# EasyEDA Pro project 16316339.epro, board 15F_PCB
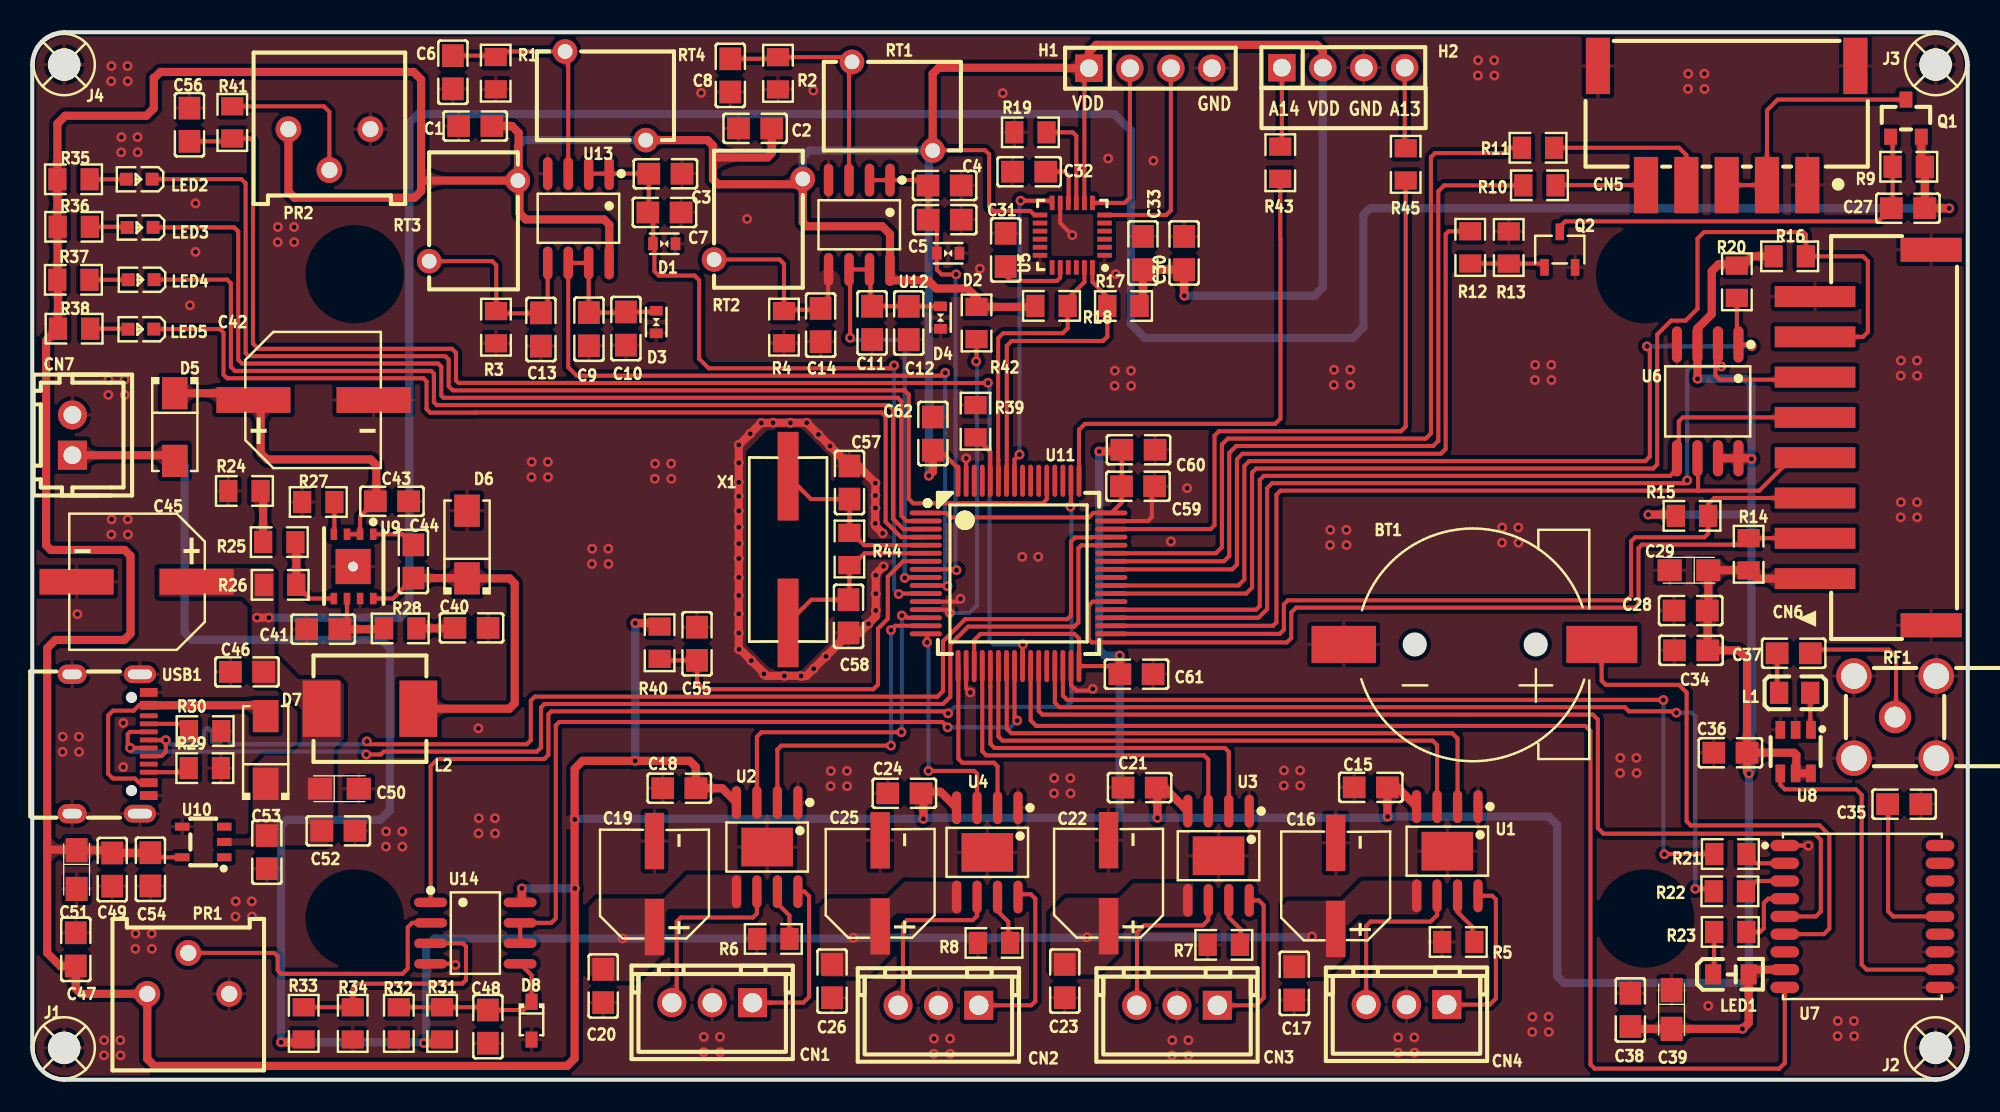
[diagram p4: board, top side]
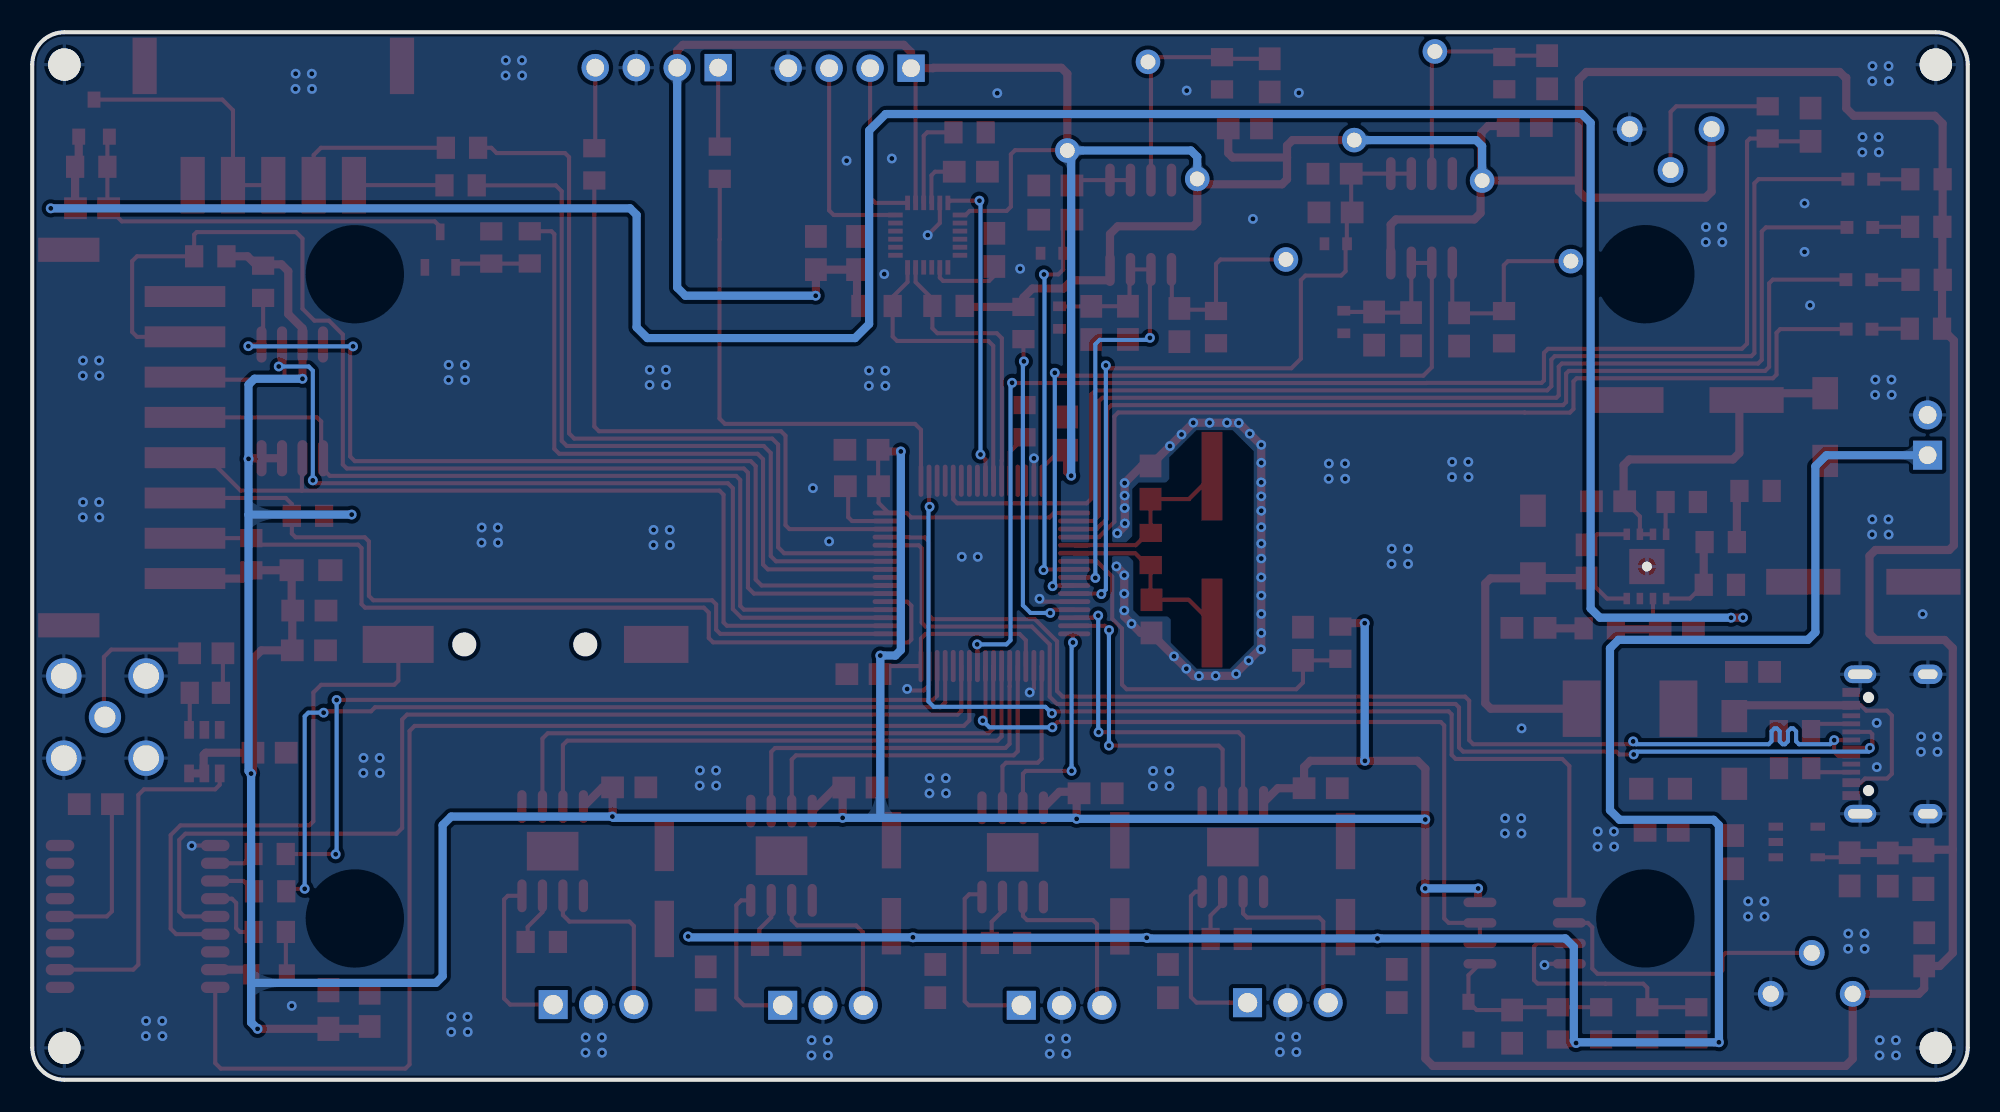
[diagram p5: board, bottom side, seen from below]

Outline 120 x 65 mm; copper layers: Top Layer, Bottom Layer. Coordinates in mm from the lower left corner of the outline.
Outline path: 0,63 0,2 arc(0.59,0.59) 2,0 118,0 arc(119.41,0.59) 120,2 120,63 arc(119.41,64.41) 118,65 2,65 arc(0.59,64.41) 0,63
Stack: Top Layer 0.035mm / Dielectric1 1.51mm FR4 er 4.5 / Bottom Layer 0.035mm

## Design rules (mm)
net USB_DP: usb
net USB_DN: usb
template: 自定义配置
spacing copperThickness1oz (default): track to track 0.203, other pairs 0.165 to 0.203
spacing copperThickness2oz: track to track 0.203, other pairs 0.152 to 0.3
track width copperThickness1oz (default): min 0.254, default 0.254, max 2.54
track width pwr: min 0.254, default 0.508, max 2.54
differential pair differentialPair (default): width min 0.254, default 0.254, max 2.54; gap min 0.203, default 0.203
via viaSize (default): diameter min 0.61, default 0.61, max 10; hole min 0.305, default 0.305, max 6.299
net GND uses pwr
net VDD uses pwr
net VBAT uses pwr
net +5V0 uses pwr
net VBUS uses pwr
net 4G_PWR uses pwr

## Placement (name value [footprint] x y rotation side)
BT1  CR1220-A  [BAT-SMD_CR1220-2]  89.31 27.01 180 top
C1  100nF  [C0805]  27.47 59.18 0 top
C2  100nF  [C0805]  44.82 59.03 0 top
C3  100nF  [C0805]  39.26 56.22 180 top
C4  100nF  [C0805]  56.57 55.49 180 top
C5  10nF  [C0805]  56.57 53.37 180 top
C6  100nF  [C0805]  26.08 62.52 90 top
C7  10nF  [C0805]  39.2 53.82 180 top
C8  100nF  [C0805]  43.28 62.32 90 top
C9  100nF  [C0805]  34.51 46.57 90 top
C10  10nF  [C0805]  36.81 46.61 90 top
C11  100nF  [C0805]  52.07 46.97 90 top
C12  10nF  [C0805]  54.34 46.96 90 top
C13  100nF  [C0805]  31.54 46.56 90 top
C14  100nF  [C0805]  48.88 46.83 90 top
C15  100nF  [C0805]  82.99 18.14 0 top
C16  100uF  [CAP-SMD_BD6.3-L6.6-W6.6-LS7.2-FD]  80.81 12.03 90 top
C17  100nF  [C0805]  78.24 5.98 90 top
C18  100nF  [C0805]  40.12 18.09 0 top
C19  100uF  [CAP-SMD_BD6.3-L6.6-W6.6-LS7.2-FD]  38.58 12.14 90 top
C20  100nF  [C0805]  35.4 5.82 90 top
C21  100nF  [C0805]  68.66 18.13 0 top
C22  100uF  [CAP-SMD_BD6.3-L6.6-W6.6-LS7.2-FD]  66.73 12.2 90 top
C23  100nF  [C0805]  64.01 6.12 90 top
C24  100nF  [C0805]  54.07 17.78 0 top
C25  100uF  [CAP-SMD_BD6.3-L6.6-W6.6-LS7.2-FD]  52.57 12.19 90 top
C26  100nF  [C0805]  49.59 6.12 90 top
C27  100nF  [C0805]  116.29 54.08 0 top
C28  100nF  [C0805]  102.82 29.11 180 top
C29  22uF  [CASE-A_3216]  102.72 31.62 180 top
C30  100nF  [C0805]  71.41 51.3 90 top
C31  2200pF  [C0805]  60.35 51.49 270 top
C32  100nF  [C0805]  61.81 56.35 180 top
C33  100nF  [C0805]  68.86 51.3 270 top
C34  100nF  [C0805]  102.85 26.64 180 top
C35  100nF  [C0805]  116.06 17.1 180 top
C36  100nF  [C0805]  105.29 20.29 180 top
C37  470pF  [C0805]  109.21 26.46 180 top
C38  100nF  [C0805]  99.08 4.33 270 top
C39  22uF  [CASE-A_3216]  101.64 4.36 270 top
C40  10nF  [C0805]  27.23 28.04 0 top
C41  15pF  [C0805]  18.04 27.95 0 top
C42  220uF  [CAP-SMD_BD8.0-L8.3-W8.3-LS9.3-FD]  17.44 42.18 0 top
C43  100nF  [C0805]  22.3 35.89 0 top
C44  100nF  [C0805]  23.63 32.16 90 top
C45  220uF  [CAP-SMD_BD8.0-L8.3-W8.3-LS9.3-FD]  6.47 30.9 180 top
C46  100nF  [C0805]  13.31 25.31 0 top
C47  100nF  [C0805]  2.7 8.09 90 top
C48  100nF  [C0805]  28.25 3.3 270 top
C49  100nF  [C0805]  4.96 13.04 270 top
C50  22uF  [CASE-A_3216]  19.04 18.06 0 top
C51  22uF  [CASE-A_3216]  2.75 13.04 270 top
C52  100nF  [C0805]  18.98 15.45 0 top
C53  10nF  [C0805]  14.54 14.12 270 top
C54  10nF  [C0805]  7.32 13.06 270 top
C55  100nF  [C0805]  41.22 27.05 90 top
C56  10nF  [C0805]  9.75 59.26 270 top
C57  20pF  [C0805]  50.67 37.06 270 top
C58  20pF  [C0805]  50.61 28.76 90 top
C59  100nF  [C0805]  68.56 36.83 0 top
C60  100nF  [C0805]  68.59 39.09 0 top
C61  100nF  [C0805]  68.46 25.17 0 top
C62  100nF  [C0805]  55.84 40.1 90 top
CN1  2.54-1*3P  [CONN-TH_C722693]  42.15 4.78 180 top
CN2  2.54-1*3P  [CONN-TH_C722693]  56.18 4.62 180 top
CN3  2.54-1*3P  [CONN-TH_C722693]  70.97 4.62 180 top
CN4  2.54-1*3P  [CONN-TH_C722693]  85.2 4.66 180 top
CN5  ZX-XH2.54-5PWT  [CONN-SMD_5P-P2.54_MEGASTAR_ZX-XH2.54-5PWT]  105.05 59.21 180 top
CN6  2.54-8P WT  [CONN-SMD_8P-P2.50_2.54-8P-WT]  114.13 39.85 90 top
CN7  ZX-XH2.54-2PZZ  [CONN-TH_2P-P2.50_HX25003-2A]  2.49 40 90 top
D1  H3V3LD5B  [SOD-523F_L1.7-W0.9-LS1.7-BI]  39.18 51.87 180 top
D2  H3V3LD5B  [SOD-523F_L1.7-W0.9-LS1.7-BI]  56.78 51.28 180 top
D3  H3V3LD5B  [SOD-523F_L1.7-W0.9-LS1.7-BI]  38.68 47.02 90 top
D4  H3V3LD5B  [SOD-523F_L1.7-W0.9-LS1.7-BI]  56.31 47.3 90 top
D5  SS34  [SMA_L4.3-W2.5-LS5.0-RD]  8.84 40.5 270 top
D6  SS34  [SMA_L4.3-W2.5-LS5.0-RD]  26.96 33.21 90 top
D7  SS34  [SMA_L4.3-W2.5-LS5.0-RD]  14.47 20.47 90 top
D8  BZT52C3V3S  [SOD-323_L1.8-W1.3-LS2.5-RD]  30.95 3.66 270 top
H1  -  [HDR-TH_4P-P2.54-V-F]  69.32 62.77 0 top
H2  -  [HDR-TH_4P-P2.54-V-M]  81.28 62.8 0 top
J1  -  [M2螺丝]  1.98 1.98 0 top
J2  -  [M2螺丝]  118.01 1.98 0 top
J3  -  [M2螺丝]  118.01 62.99 0 top
J4  -  [M2螺丝]  1.98 62.99 0 top
L1  6.8nH  [L0805]  109.27 24.01 180 top
L2  10uH  [IND-SMD_L7.3-W6.8]  20.94 23.03 180 top
LED1  -  [LED_0805]  105.37 6.53 0 top
LED2  -  [LED_0603]  6.58 55.87 180 top
LED3  -  [LED_0603]  6.64 52.88 180 top
LED4  -  [LED_0603]  6.7 49.64 180 top
LED5  -  [LED_0603]  6.69 46.57 180 top
PR1  10K  [R_3386P]  9.67 5.33 270 top
PR2  10K  [R_3386P]  18.42 58.99 90 top
Q1  AO3401A  [SOT-23_L2.9-W1.3-P1.90-LS2.4-BR]  116.17 59.67 270 top
Q2  S8050 J3Y  [SOT-23-3_L3.0-W1.7-P0.95-LS2.9-BR]  94.71 51.51 270 top
R1  4.7K  [R0805]  28.73 62.46 90 top
R2  4.7K  [R0805]  46.23 62.45 90 top
R3  4.7K  [R0805]  28.75 46.7 90 top
R4  4.7K  [R0805]  46.61 46.7 90 top
R5  0.1R  [R0805]  88.41 8.55 180 top
R6  0.1R  [R0805]  45.95 8.74 180 top
R7  0.1R  [R0805]  73.88 8.37 180 top
R8  0.1R  [R0805]  59.63 8.49 180 top
R9  10K  [R0805]  116.34 56.65 0 top
R10  1K  [R0805]  93.44 55.5 0 top
R11  1K  [R0805]  93.36 57.83 0 top
R12  4.7K  [R0805]  89.15 51.65 90 top
R13  4.7K  [R0805]  91.54 51.64 270 top
R14  10K  [R0805]  106.42 32.61 270 top
R15  10K  [R0805]  102.91 34.99 180 top
R16  10K  [R0805]  108.96 51.1 180 top
R17  10K  [R0805]  67.66 48.01 0 top
R18  10K  [R0805]  63.19 48.02 180 top
R19  10K  [R0805]  61.88 58.79 0 top
R20  10K  [R0805]  105.69 49.52 90 top
R21  330R  [R0805]  105.28 14.01 0 top
R22  330R  [R0805]  105.25 11.69 0 top
R23  330R  [R0805]  105.28 9.17 0 top
R24  ADJ  [R0805]  13.15 36.54 0 top
R25  10K  [R0805]  15.31 33.36 0 top
R26  ADJ  [R0805]  15.37 30.71 180 top
R27  47K  [R0805]  17.73 35.85 180 top
R28  27K  [R0805]  22.81 28.01 0 top
R29  5.1K  [R0805]  10.7 19.34 0 top
R30  5.1K  [R0805]  10.72 21.64 0 top
R31  10K  [R0805]  25.41 3.5 90 top
R32  2K  [R0805]  22.73 3.5 90 top
R33  10K  [R0805]  16.83 3.5 270 top
R34  2K  [R0805]  19.87 3.5 270 top
R35  300R  [R0805]  2.56 55.87 180 top
R36  300R  [R0805]  2.57 52.93 180 top
R37  300R  [R0805]  2.55 49.64 180 top
R38  300R  [R0805]  2.59 46.6 180 top
R39  10K  [R0805]  58.48 40.86 270 top
R40  10K  [R0805]  38.9 27.12 90 top
R41  10K  [R0805]  12.4 59.4 270 top
R42  0R  [R0805]  58.55 46.96 90 top
R43  100R  [R0805]  77.38 56.9 270 top
R44  1M  [R0805]  50.66 32.93 270 top
R45  100R  [R0805]  85.15 56.8 270 top
RF1  BWSMA-KWE-Z001  [SMA-TH_BWSMA-KWE-Z001]  115.49 22.5 0 top
RT1  NTC 5D-7  [RES-TH_L8.5-W5.5-P5.00-D0.6-S5.50]  53.32 60.41 180 top
RT2  NTC 5D-7  [RES-TH_L8.5-W5.5-P5.00-D0.6-S5.50]  45.02 53.4 270 top
RT3  NTC 5D-7  [RES-TH_L8.5-W5.5-P5.00-D0.6-S5.50]  27.36 53.29 270 top
RT4  NTC 5D-7  [RES-TH_L8.5-W5.5-P5.00-D0.6-S5.50]  35.54 61.06 180 top
U1  TB67H450FNG,EL  [HSOP-8_L5.0-W4.0-P1.27-LS6.2-BL-EP]  87.73 14.18 180 top
U2  TB67H450FNG,EL  [HSOP-8_L5.0-W4.0-P1.27-LS6.2-BL-EP]  45.56 14.44 180 top
U3  TB67H450FNG,EL  [HSOP-8_L5.0-W4.0-P1.27-LS6.2-BL-EP]  73.55 13.9 180 top
U4  TB67H450FNG,EL  [HSOP-8_L5.0-W4.0-P1.27-LS6.2-BL-EP]  59.21 14.11 180 top
U5  MPU6050  [QFN-24_L4.0-W4.0-P0.50-BL]  64.48 52.41 90 top
U6  W25Q32JVSSIQ  [SOIC-8_L5.3-W5.3-P1.27-LS8.0-BL]  103.88 42.1 180 top
U7  ATGM336H-5N31  [GPSM-SMD_ATGM336H-TR]  113.47 10.13 90 top
U8  AT2659S  [SOT-23-6_L2.9-W1.6-P0.95-LS2.8-BR]  109.33 20.36 90 top
U9  X3DC  [QN_X3DC]  21.14 33.85 270 top
U10  XC6206J332MR-G  [SOT-25_L3.0-W1.6-P0.95-LS2.8-BR]  10.6 14.75 0 top
U11  GD32F307RCT6  [LQFP-64_L10.0-W10.0-P0.50-LS12.0-BL]  61.15 31.42 270 top
U12  GS8552-SR  [SOIC-8_L4.9-W3.9-P1.27-LS6.0-BL]  51.27 53.05 180 top
U13  GS8552-SR  [SOIC-8_L4.9-W3.9-P1.27-LS6.0-BL]  33.86 53.45 180 top
U14  GS8552-SR  [SOIC-8_L4.9-W3.9-P1.27-LS6.0-BL]  27.47 9.1 270 top
USB1  TYPE-C 16PIN 2MD(073)  [USB-C-SMD_TYPE-C-6PIN-2MD-073]  4.85 20.84 270 top
X1  25MHz  [HC-49S_L11.4-W4.8]  46.86 32.9 90 top

## Footprints (pads in the part's own frame, mm; a bottom-side part is the same pattern mirrored in y, then rotated)
BAT-SMD_CR1220-2
  rect 4.4x2.3 smd: 1(-8,0)
  rect 4x2.3 smd: 2(8,0)
C0805
  rect 1.41x1.35 smd: 1(-1.03,0) 2(1.03,0)
CAP-SMD_BD6.3-L6.6-W6.6-LS7.2-FD
  rect 3.5x1.2 smd: 1(-2.67,0) 2(2.67,0)
CAP-SMD_BD8.0-L8.3-W8.3-LS9.3-FD
  rect 4.6x1.6 smd: 1(-3.724,0) 2(3.724,0)
CASE-A_3216
  rect 1.5x1.359 smd: 1(-1.2,0) 2(1.2,0)
CONN-SMD_5P-P2.54_MEGASTAR_ZX-XH2.54-5PWT
  rect 1.5x3.5 smd: 1(-5,3.7) 2(-2.5,3.7) 3(0,3.7) 4(2.5,3.7) 5(5,3.7) 6(7.98,-3.7) 7(-7.98,-3.7)
CONN-SMD_8P-P2.50_2.54-8P-WT
  rect 1.3x5 smd: 1(-8.75,3.6) 2(-6.25,3.6) 3(-3.75,3.6) 4(-1.25,3.6) 5(1.25,3.6) 6(3.75,3.6) 7(6.25,3.6) 8(8.75,3.6)
  rect 1.5x3.8 smd: 9(11.65,-3.6) 10(-11.65,-3.6)
CONN-TH_2P-P2.50_HX25003-2A
  rect 1.8x1.8 hole 1.1: 1(-1.25,0)
  round 1.8 hole 1.1: 2(1.25,0)
CONN-TH_C722693
  rect 1.8x1.8 hole 1.2: 1(-2.5,0)
  round 1.8 hole 1.2: 2(0,0) 3(2.5,0)
GPSM-SMD_ATGM336H-TR
  oval 0.7x1.773 smd: 1(4.4,4.811) 2(3.3,4.811) 3(2.2,4.811) 4(1.1,4.811) 5(0,4.811) 6(-1.1,4.811) 7(-2.2,4.811) 8(-3.3,4.811) 9(-4.4,4.811) 10(-4.4,-4.811) 11(-3.3,-4.811) 12(-2.2,-4.811) 13(-1.1,-4.811) 14(0,-4.811) 15(1.1,-4.811) 16(2.2,-4.811) 17(3.3,-4.811) 18(4.4,-4.811)
HC-49S_L11.4-W4.8
  rect 5.5x1.3 smd: 1(-4.553,0) 2(4.553,0)
HDR-TH_4P-P2.54-V-F
  rect 1.7x1.7 hole 1.1: 1(-3.81,0)
  round 1.7 hole 1.1: 2(-1.27,0) 3(1.27,0) 4(3.81,0)
HDR-TH_4P-P2.54-V-M
  rect 1.7x1.7 hole 1.1: 1(-3.81,0)
  round 1.7 hole 1.1: 2(-1.27,0) 3(1.27,0) 4(3.81,0)
HSOP-8_L5.0-W4.0-P1.27-LS6.2-BL-EP
  oval 0.574x2.038 smd: 1(-1.905,-2.769) 2(-0.635,-2.769) 3(0.635,-2.769) 4(1.905,-2.769) 5(1.905,2.769) 6(0.635,2.769) 7(-0.635,2.769) 8(-1.905,2.769)
  rect 3.2x2.4 smd: 9(0,0)
IND-SMD_L7.3-W6.8
  rect 2.35x3.5 smd: 1(-3,0) 2(3,0)
L0805
  rect 1.133x1.377 smd: 1(-0.966,0) 2(0.966,0)
LED_0603
  rect 0.8x0.8 smd: 1(-0.851,-0.01) 2(0.75,-0.005)
LED_0805
  rect 1x1.25 smd: 1(-1.15,0.005) 2(1.05,0.005)
LQFP-64_L10.0-W10.0-P0.50-LS12.0-BL
  oval 0.3x2 smd: 1(-3.75,-5.75) 2(-3.25,-5.75) 3(-2.75,-5.75) 4(-2.25,-5.75) 5(-1.75,-5.75) 6(-1.25,-5.75) 7(-0.75,-5.75) 8(-0.25,-5.75) 9(0.25,-5.75) 10(0.75,-5.75) 11(1.25,-5.75) 12(1.75,-5.75) 13(2.25,-5.75) 14(2.75,-5.75) 15(3.25,-5.75) 16(3.75,-5.75) 33(3.75,5.75) 34(3.25,5.75) 35(2.75,5.75) 36(2.25,5.75) 37(1.75,5.75) 38(1.25,5.75) 39(0.75,5.75) 40(0.25,5.75) 41(-0.25,5.75) 42(-0.75,5.75) 43(-1.25,5.75) 44(-1.75,5.75) 45(-2.25,5.75) 46(-2.75,5.75) 47(-3.25,5.75) 48(-3.75,5.75)
  oval 2x0.3 smd: 17(5.75,-3.75) 18(5.75,-3.25) 19(5.75,-2.75) 20(5.75,-2.25) 21(5.75,-1.75) 22(5.75,-1.25) 23(5.75,-0.75) 24(5.75,-0.25) 25(5.75,0.25) 26(5.75,0.75) 27(5.75,1.25) 28(5.75,1.75) 29(5.75,2.25) 30(5.75,2.75) 31(5.75,3.25) 32(5.75,3.75) 49(-5.75,3.75) 50(-5.75,3.25) 51(-5.75,2.75) 52(-5.75,2.25) 53(-5.75,1.75) 54(-5.75,1.25) 55(-5.75,0.75) 56(-5.75,0.25) 57(-5.75,-0.25) 58(-5.75,-0.75) 59(-5.75,-1.25) 60(-5.75,-1.75) 61(-5.75,-2.25) 62(-5.75,-2.75) 63(-5.75,-3.25) 64(-5.75,-3.75)
M2螺丝
  round 2 hole 2: 1(0,0)
QFN-24_L4.0-W4.0-P0.50-BL
  rect 0.3x0.9 smd: 1(-1.25,-2) 2(-0.75,-2) 3(-0.25,-2) 4(0.25,-2) 5(0.75,-2) 6(1.25,-2) 13(1.25,2) 14(0.75,2) 15(0.25,2) 16(-0.25,2) 17(-0.75,2) 18(-1.25,2)
  rect 0.9x0.3 smd: 7(2,-1.25) 8(2,-0.75) 9(2,-0.25) 10(2,0.25) 11(2,0.75) 12(2,1.25) 19(-2,1.25) 20(-2,0.75) 21(-2,0.25) 22(-2,-0.25) 23(-2,-0.75) 24(-2,-1.25)
QN_X3DC
  rect 0.711x0.406 smd: 1(0,0) 2(0,-0.813) 3(0,-1.625) 4(0,-2.438) 5(3.988,-2.438) 6(3.988,-1.625) 7(3.988,-0.813) 8(3.988,0)
  round 0.61 hole 1.31x0.305: 9(2.002,-1.248)
  rect 2.184x2.184 smd: 9(2.002,-1.248)
R0805
  rect 1.133x1.377 smd: 1(-1,0) 2(1,0)
R_3386P
  round 1.6 hole 1.001: 1(0,-2.54) 2(-2.54,0) 3(0,2.54)
RES-TH_L8.5-W5.5-P5.00-D0.6-S5.50
  round 1.524 hole 0.914: 1(-2.5,2.75) 2(2.5,-2.75)
SMA-TH_BWSMA-KWE-Z001
  round 2.2 hole 1.6: 1(-2.55,-2.55) 2(-2.55,2.55) 3(2.55,2.55) 4(2.55,-2.55)
  round 2 hole 1.3: 5(0,0)
SMA_L4.3-W2.5-LS5.0-RD
  rect 2x1.593 smd: 1(-2.1,0) 2(2.1,0)
SOD-323_L1.8-W1.3-LS2.5-RD
  rect 1x0.75 smd: 1(-1.173,0) 2(1.173,0)
SOD-523F_L1.7-W0.9-LS1.7-BI
  rect 0.6x0.8 smd: 1(-0.7,0) 2(0.7,0)
SOIC-8_L4.9-W3.9-P1.27-LS6.0-BL
  oval 0.588x2.045 smd: 1(-1.905,-2.772) 2(-0.635,-2.772) 3(0.635,-2.772) 4(1.905,-2.772) 5(1.905,2.772) 6(0.635,2.772) 7(-0.635,2.772) 8(-1.905,2.772)
SOIC-8_L5.3-W5.3-P1.27-LS8.0-BL
  oval 0.63x2.25 smd: 1(-1.905,-3.53) 2(-0.635,-3.53) 3(0.635,-3.53) 4(1.905,-3.53) 5(1.905,3.53) 6(0.635,3.53) 7(-0.635,3.53) 8(-1.905,3.53)
SOT-23-3_L3.0-W1.7-P0.95-LS2.9-BR
  rect 1.038x0.532 smd: 1(1.101,-0.95) 2(1.101,0.95) 3(-1.101,0)
SOT-23-6_L2.9-W1.6-P0.95-LS2.8-BR
  rect 1.1x0.6 smd: 1(1.35,-0.95) 2(1.35,0) 3(1.35,0.95) 4(-1.35,0.95) 5(-1.35,0) 6(-1.35,-0.95)
SOT-23_L2.9-W1.3-P1.90-LS2.4-BR
  rect 1x0.8 smd: 1(1.15,-0.95) 2(1.15,0.95) 3(-1.15,0)
SOT-25_L3.0-W1.6-P0.95-LS2.8-BR
  rect 0.9x0.5 smd: 1(1.3,-0.95) 2(1.3,0) 3(1.3,0.95) 4(-1.3,0.95) 5(-1.3,-0.95)
USB-C-SMD_TYPE-C-6PIN-2MD-073
  rect 0.55x1.1 smd: 1(-3.2,2.375) 2(-2.4,2.375) 11(2.4,2.375) 12(3.2,2.375)
  rect 0.3x1.1 smd: 3(-1.75,2.375) 4(-1.25,2.375) 5(-0.75,2.375) 6(-0.25,2.375) 7(0.25,2.375) 8(0.75,2.375) 9(1.25,2.375) 10(1.75,2.375)
  oval 1.1x2 hole 0.6x1.5: 13(-4.325,1.825) 14(4.325,1.825)
  oval 1.2x1.8 hole 0.6x1.2: 13(-4.325,-2.375) 14(4.325,-2.375)

## Nets
As in the schematic.

Pads without a net: U5 2 3 4 5 14 15 16 17 19 21 22; U7 7 13 15 16 17 18; U10 1 3; U11 28 40 51 52 54 55 56 61 62; USB1 3 9

## Via types
v1: diameter 0.61, hole 0.305, Top Layer to Bottom Layer, 257 vias

## Routing (per net, layer and track width the routed paths; a pad name or vN(x,y) marks a point on that pad's centre or on a via; arc(x,y) is an arc through that point)
+5V0: length 161.8
  Top Layer w0.508: v1(14.67,28.67) 14.67,28.67 v1(13.93,28.67) ; v1(118.85,54.07) 118.85,54.08 C27.2 117.34,54.1 R9.2 117.12,56.88 Q1.2
  Bottom Layer w0.508: v1(118.85,54.07) 82.94,54.07 82.53,53.67 82.53,46.69 81.86,46.02 68.99,46.02 68.12,46.89 68.12,58.9 67.09,59.92 23.92,59.92 23.38,59.38 23.38,29.25 22.81,28.67 v1(14.67,28.67)
GND: length 58.7
  Top Layer w0.254: U11.47 69.17,34.67 69.41,34.91 69.41,36.65 C59.2 ; U5.11 63.73,53.16 v1(64.48,52.41) ; U14.4 26.17,7.2 v1(26.24,7.12) ; U11.31 64.4,24.49 64.73,24.16 65.66,24.16 v1(65.76,24.25) ; v1(110.11,14.52) 110.1,14.53 U7.1 ; U11.12 57.38,29.67 v1(57.55,29.84) ; U11.18 57.9,24.29 v1(58.16,24.03) ; 57.9,37.17 v1(57.9,38.56)
  Top Layer w0.508: v1(52.78,31.86) 52.3,31.37 v1(52.3,31.3) v1(52.3,30.16) v1(52.3,29.12) 52.3,28.75 v1(51.84,28.3) 51.27,27.73 C58.1 50.61,27.67 v1(49.21,26.28) v1(48.45,25.51) 47.99,25.05 v1(47.66,25.05) 47.65,25.06 v1(46.63,25.06) 45.48,25.06 v1(45.36,25.18) 45.36,25.23 v1(44.58,26.01) 43.8,26.79 v1(43.8,27.72) v1(43.8,28.91) v1(43.8,30.05) v1(43.8,31.17) v1(43.8,32.34) v1(43.8,33.27) v1(43.8,34.29) v1(43.8,35.31) v1(43.8,36.2) v1(43.8,37.07) v1(43.8,38.29) v1(43.8,39.4) 43.82,39.4 v1(44.51,40.09) 45.18,40.75 v1(45.2,40.75) 45.91,40.75 v1(45.93,40.77) v1(47.01,40.77) v1(48.02,40.77) v1(48.75,40.04) v1(49.46,39.32) 50.67,38.12 C57.1 51.21,38.09 v1(52.27,37.03) v1(52.27,36.25) v1(52.27,35.47) 52.26,35.46 v1(52.26,34.52) 52.26,34.37 v1(52.73,33.91)
  vias: v1(1.89,21.29) v1(1.88,20.35) v1(2.8,28.89) v1(2.89,21.29) v1(2.9,20.35) v1(4.44,1.51) v1(4.46,2.45) v1(4.73,43.44) v1(4.72,42.5) v1(4.91,62.9) v1(4.89,61.96) v1(4.92,34.77) v1(4.9,33.83) v1(5.52,58.49) v1(5.51,57.55) v1(5.46,2.45) v1(5.47,1.51) v1(5.64,22.14) v1(5.64,19.4) v1(5.73,43.44) v1(5.74,42.5) v1(5.91,62.9) v1(5.92,61.96) v1(5.92,34.77) v1(5.93,33.83) v1(6.41,9.07) v1(6.39,8.13) v1(6.53,58.49) v1(6.54,57.55) v1(7.41,9.07) v1(7.42,8.13) v1(9.78,48.05) v1(10.12,54.38) v1(10.12,51.37) v1(12.61,11.07) v1(12.6,10.13) v1(13.61,11.07) v1(13.62,10.13) v1(15.23,52.91) v1(15.22,51.97) v1(16.23,52.91) v1(16.24,51.97) v1(21.94,15.41) v1(21.93,14.47) v1(22.94,15.41) v1(22.95,14.47) v1(27.66,21.81) v1(27.68,16.23) v1(27.67,15.29) v1(28.68,16.23) v1(28.69,15.29) v1(30.97,38.34) v1(30.95,37.4) v1(31.97,38.34) v1(31.98,37.4) v1(34.71,32.95) v1(34.7,32.01) v1(35.71,32.95) v1(35.72,32.01) v1(38.61,38.23) v1(38.6,37.29) v1(39.61,38.23) v1(39.62,37.29) v1(41.47,61.24) v1(41.64,2.66) v1(41.63,1.72) v1(42.64,2.66) v1(42.65,1.72) v1(43.82,26.7) v1(44.32,53.42) v1(48.43,61.38) v1(49.51,19.16) v1(49.5,18.22) v1(50.51,19.16) v1(50.52,18.22) v1(55.91,2.56) v1(55.89,1.61) v1(56.91,2.56) v1(56.92,1.61) v1(58.75,50.33) v1(60.17,61.22) v1(61.38,32.45) v1(62.37,32.45) v1(63.35,17.77) v1(63.36,18.71) v1(64.36,18.71) v1(64.37,17.77) v1(66.71,57.17) v1(67.12,44) v1(67.11,43.06) v1(67.18,49.99) v1(68.12,44) v1(68.13,43.06) v1(69.51,57.03) v1(70.59,33.41) v1(70.68,2.45) v1(70.67,1.51) v1(71.6,36.71) v1(71.68,2.45) v1(71.69,1.51) v1(77.61,19.19) v1(77.59,18.25) v1(78.61,19.19) v1(78.62,18.25) v1(80.48,34.12) v1(80.46,33.18) v1(80.71,44.05) v1(80.7,43.11) v1(81.48,34.12) v1(81.49,33.18) v1(81.71,44.05) v1(81.72,43.11) v1(84.69,2.62) v1(84.67,1.68) v1(85.69,2.62) v1(85.7,1.68) v1(89.64,63.26) v1(89.63,62.31) v1(90.64,63.26) v1(90.65,62.31) v1(91.13,34.27) v1(91.12,33.33) v1(92.14,34.27) v1(92.15,33.33) v1(93.01,3.91) v1(93,2.96) v1(93.18,44.36) v1(93.17,43.42) v1(94.01,3.91) v1(94.02,2.96) v1(94.18,44.36) v1(94.19,43.42) v1(98.45,19.03) v1(98.46,19.97) v1(99.46,19.97) v1(99.47,19.03) v1(102.67,62.43) v1(102.66,61.48) v1(103.67,62.43) v1(103.68,61.48) v1(103.91,4.59) v1(111.94,3.65) v1(111.93,2.71) v1(112.94,3.65) v1(112.95,2.71) v1(115.84,43.69) v1(115.84,34.9) v1(115.85,44.63) v1(115.85,35.84) v1(116.85,44.63) v1(116.87,43.69) v1(116.85,35.84) v1(116.87,34.9)
VBAT: length 140.6
  Top Layer w0.508: v1(15.43,2.33) 16.66,2.33 R33.2 ; CN7.1 8.48,38.75 D5.2 ; v1(24.28,2.28) 25.19,2.28 R31.1
  Bottom Layer w0.508: v1(79.34,8.9) 79.28,8.84 v1(65.4,8.84) 65.37,8.81 v1(50.9,8.81) 50.86,8.77 v1(36.6,8.77) 24.94,8.77 24.42,8.25 24.42,2.42 v1(24.28,2.28) 24.24,2.33 v1(15.43,2.33) 15.43,15.79 15.76,16.13 21.58,16.13 22.18,16.73 22.18,26.77 21.65,27.3 9.91,27.3 9.45,27.76 9.45,38.06 8.76,38.75 CN7.1
VBUS: length 16.7
  Top Layer w0.254: USB1.2 6.62,23.24 6.29,22.9 5.01,22.9 4.71,22.6 4.71,18.98 5,18.69 6.37,18.69 6.62,18.44 USB1.11
  Top Layer w0.508: USB1.2 13.8,23.24 D7.2
VDD: length 636.1
  Top Layer w0.254: U5.8 65.23,61.96 65.21,61.98 ; RT1.1 55.84,57.68 59.07,57.68 59.33,57.42 59.33,54.18 59.59,53.91 61.88,53.91 62.13,53.66 U5.13 ; C61.1 66.93,25.67 U11.32 64.9,27.38 64.61,27.67 58.79,27.67 58.4,27.27 U11.19 ; C60.1 67.56,36.86 C59.1 67.53,35.8 U11.48 65.78,35.17 65.51,34.89 56.93,34.89 56.65,35.17 U11.1 ; 109.37,19.05 U8.5 ; U10.5 7.54,13.81 7.46,13.88 ; U11.64 57.4,37.94 56.27,39.07 C62.1
  Top Layer w0.508: 33.63,11.87 33.63,19.3 34.12,19.79 40.76,19.79 41.15,19.41 41.15,18.09 42.78,18.09 U2.4 ; 33.63,11.87 v1(33.64,11.87) ; 33.63,11.87 33.63,1.32 33.17,0.86 7.57,0.86 7.13,1.3 PR1.1 3.03,5.33 2.7,5.67 C47.1 1.73,7.06 0.93,7.87 0.93,14.28 ; U14.8 30.36,11.12 v1(30.36,11.87) ; RT3.1 24.15,55.79 ; RT3.1 30.21,55.7 30.21,53.77 30.59,53.39 35.45,53.39 35.78,53.06 35.78,50.69 U13.8 ; RT3.1 30.15,55.84 30.15,58.76 29.74,59.18 C1.2 ; R40.2 38.68,28.33 v1(37.39,28.33) ; U8.6 109.42,19.01 109.37,19.05 109.37,20.16 109.24,20.29 C36.1 ; v1(106.59,38.53) 106.56,38.57 U6.8 U6.7 ; C30.1 71.41,48.67 v1(71.43,48.65) ; C61.1 67.43,26.31 v1(67.42,26.32) ; 0.93,14.28 2.09,14.28 2.13,14.24 C51.1 4.79,14.24 4.96,14.07 7.31,14.07 C54.1 ; 0.93,14.28 0.93,26.78 1.44,27.29 5.7,27.29 6.09,27.68 6.09,32.51 5.72,32.88 1.15,32.88 0.86,33.17 0.86,45.87 R38.2 1.59,49.59 R37.2 1.57,49.66 R36.2 1.56,52.94 R35.2 1.56,59.33 2.04,59.82 7.07,59.82 7.53,60.28 7.53,62.18 7.59,62.18 7.94,62.54 23.64,62.54 24.11,62.07 24.11,55.14 23.7,54.73 16.25,54.73 15.88,55.11 PR2.3 ; v1(66.15,38.99) 67.45,38.99 C60.1 ; C38.2 99.23,3.16 C39.2 106.06,3.16 106.42,3.52 LED1.2 106.71,6.83 U7.8 ; RT1.1 55.82,62.42 56.19,62.79 64.13,62.79 64.16,62.77 H1.1 65.51,63.76 65.97,64.22 79.66,64.22 80.01,63.86 H2.2 ; RT4.1 41.87,58.31 42.2,57.97 42.2,57.23 ; R15.2 101.83,35.07 v1(100.2,35.07) ; 55.21,18.04 55.38,17.87 56.32,17.87 57.31,16.88 ; CN6.1 106.92,31.1 R14.2 106.41,31.62 C29.1 103.92,29.18 C28.1 103.88,29.09 C34.1 105.8,26.64 106.32,26.13 C36.1 ; R17.2 68.86,48.22 C33.2 71.41,50.27 ; 42.2,57.23 45.58,57.23 45.85,57.5 C2.2 ; 42.2,57.23 42.2,55.88 42.52,55.56 47.44,55.56 RT2.1 47.77,53.21 48.02,52.96 52.7,52.96 53.18,52.48 U12.8 53.18,49.61 55.55,49.61 56.06,49.1 57.99,49.1 58.55,48.54 R42.2 62.13,47.96 R18.2 ; v1(103.25,43.5) 103.24,43.5 U6.3 103.24,46.63 104.13,47.51 104.13,50.17 104.55,50.6 105.61,50.6 R20.2 106.07,50.52 106.65,51.1 R16.2 ; U1.4 84.64,18.14 C15.2 84.02,16.34 v1(84.03,16.33) ; v1(106.43,19) 106.32,19.12 C36.1 ; U3.4 70.18,18.13 C21.2 69.76,18.06 v1(69.76,16.25) ; v1(55.59,37.48) 55.84,37.73 C62.1 ; C24.2 55.25,17.63 v1(55.25,16.19)
  Bottom Layer w0.508: H2.2 80.01,49.16 79.51,48.65 v1(71.43,48.65) ; v1(37.38,19.79) 37.39,19.8 v1(37.39,28.33) ; 106.59,35.07 106.59,19.16 v1(106.43,19) 106.43,6.03 ; 106.59,35.07 v1(100.2,35.07) ; 106.59,35.07 v1(106.59,38.53) 106.59,43.13 106.22,43.5 v1(103.25,43.5) ; 106.43,6.03 106.42,6.01 94.97,6.01 94.56,6.42 94.56,15.8 94.03,16.33 v1(84.03,16.33) 83.95,16.25 v1(69.76,16.25) 67.36,16.25 ; 106.43,6.03 106.43,3.56 v1(106.03,3.16) ; RT4.1 30.48,58.31 30.11,57.93 RT3.1 ; 67.36,16.25 67.42,16.32 v1(67.42,26.32) 66.49,26.32 66.15,26.66 v1(66.15,38.99) ; 67.36,16.25 55.31,16.25 v1(55.25,16.19) 33.67,16.19 v1(33.63,16.15) ; RT2.1 47.77,57.27 48.16,57.66 RT1.1 55.59,57.42 v1(55.59,37.48) ; v1(30.36,11.87) v1(33.64,11.87)
4G_PWR: length 42.6
  Top Layer w0.254: U11.41 74.39,31.67 74.69,31.97 74.69,38.51 75.03,38.84 87.33,38.84 87.63,39.15 87.63,52.47 87.81,52.65 R12.2
4G_RXD: length 48
  Top Layer w0.254: R10.1 87.54,55.5 87.17,55.13 87.17,39.65 86.86,39.33 74.65,39.33 74.21,38.89 74.21,32.5 73.88,32.17 U11.42
4G_TXD: length 49.7
  Top Layer w0.254: R11.1 91.54,57.83 91.21,57.5 86.97,57.5 86.72,57.25 86.72,40.11 86.39,39.78 74.12,39.78 73.76,39.42 73.76,33.04 73.38,32.67 U11.43
ADC_MOT_TEMP1: length 30.8
  Top Layer w0.254: v1(57.3,31.62) 57.26,31.67 U11.8 ; 53.15,55.79 53.15,55.83 U12.2 ; U12.1 55.2,55.83 C4.2 55.54,55.48 C5.2 56.08,52.83 D2.2 56.08,50.27 56.38,49.97 v1(57.28,49.97)
  Bottom Layer w0.254: v1(57.28,49.97) 57.24,49.93 57.24,31.69 v1(57.3,31.62)
ADC_MOT_TEMP2: length 32.2
  Top Layer w0.254: v1(54.09,31.14) 54.12,31.17 U11.9 ; 51.97,50.69 51.97,48.17 51.79,48 54.22,48 54.23,47.99 56.31,47.99 D4.2 ; U12.7 U12.6 50.71,50.21 v1(50.71,46.04)
  Bottom Layer w0.254: v1(54.09,31.14) 54.09,45.64 53.82,45.91 50.84,45.91 v1(50.71,46.04)
ADC_MOT_TEMP3: length 53.5
  Top Layer w0.254: v1(56.6,43.87) 56.43,43.69 33.75,43.69 33.23,44.21 U13.6 U13.7 34.5,47.78 34.32,47.6 36.57,47.6 36.61,47.64 38.47,47.64 38.52,47.7 ; v1(56.74,30.63) 56.7,30.67 U11.10
  Bottom Layer w0.254: v1(56.6,43.87) 56.6,30.76 v1(56.74,30.63)
ADC_MOT_TEMP4: length 47
  Top Layer w0.254: 38.57,51.78 38.57,51.93 38.5,52.01 38.5,53.49 ; 38.57,51.78 D1.2 ; 38.57,51.78 38.57,50.17 38.84,49.9 41.06,49.9 41.35,49.62 41.35,44.74 41.94,44.15 53.26,44.15 v1(53.44,44.33) ; 38.5,53.49 38.5,53.65 38.17,53.98 38.23,54.04 38.23,56.31 38.14,56.23 U13.1 U13.2 ; 38.5,53.49 C7.2 ; v1(53.72,30.14) 53.75,30.17 U11.11
  Bottom Layer w0.254: v1(53.72,30.14) 53.44,30.42 v1(53.44,44.33)
BAT_ADC: length 48
  Top Layer w0.254: v1(61.07,22.29) 60.9,22.46 U11.24 ; v1(56.75,21.87) 56.42,22.2 32.67,22.2 32.46,21.99 32.46,10.01 32.18,9.74 U14.7 U14.6
  Bottom Layer w0.254: v1(56.75,21.87) 60.65,21.87 v1(61.07,22.29)
BAT_INT: length 65.2
  Top Layer w0.254: v1(56.78,22.74) 56.66,22.86 32.19,22.86 32,22.67 32,20.16 31.75,19.91 25.14,19.91 24.7,19.47 U14.1 ; U11.50 64.4,35.59 v1(64.37,35.56)
  Bottom Layer w0.254: v1(56.78,22.74) 57.19,23.14 64.1,23.14 64.43,23.47 64.43,35.49 v1(64.37,35.56)
GPS_PWR: length 65.3
  Top Layer w0.254: U7.5 110.58,10.13 110.89,10.45 110.89,14.88 110.5,15.27 97.42,15.27 97.07,15.62 97.07,22.35 96.76,22.66 62.63,22.66 62.4,22.89 U11.27
GPS_RST: length 76
  Top Layer w0.254: U11.26 61.9,22.3 62.24,21.96 96.29,21.96 96.61,21.64 96.61,0.95 96.87,0.69 108.31,0.69 108.66,1.04 U7.9
GPS_RXD: length 54.2
  Top Layer w0.254: U11.29 63.4,23.41 63.69,23.12 98.74,23.12 99,22.86 101.85,22.86 v1(101.94,22.78) ; v1(103.11,11.85) 104.1,11.85 R22.1
  Bottom Layer w0.254: v1(101.94,22.78) 102.88,22.78 103.11,22.55 v1(103.11,11.85)
GPS_TXD: length 51.9
  Top Layer w0.254: R21.1 101.21,14.01 v1(101.19,13.99) ; v1(101.13,23.56) 101.12,23.57 64.16,23.57 63.9,23.83 U11.30
  Bottom Layer w0.254: v1(101.19,13.99) 101.13,14.05 v1(101.13,23.56)
MM_CS: length 58
  Top Layer w0.254: U6.1 106.5,45.63 v1(106.6,45.52) ; v1(100.11,45.51) 100.29,45.33 100.29,38.67 100,38.39 75.45,38.39 75.15,38.08 75.15,31.04 74.78,30.67 U11.39 ; 105.62,45.67 105.69,45.73 R20.1
  Bottom Layer w0.254: v1(100.11,45.51) 106.59,45.51 v1(106.6,45.52)
OSC_IN: length 11.5
  Top Layer w0.254: U11.5 51.59,33.17 50.82,33.93 R44.1 50.67,33.94 C57.2 48.28,36.03 X1.2
OSC_OUT: length 11.6
  Top Layer w0.254: R44.2 50.66,31.72 ; 50.66,31.72 50.66,29.84 C58.2 48.3,29.79 X1.1 ; 50.66,31.72 51.61,32.67 U11.6
RF_CE: length 54.4
  Top Layer w0.254: U11.37 65.75,29.67 65.5,29.42 65.5,27.32 65.68,27.14 77.79,27.14 78.06,27.41 78.06,28.99 78.36,29.29 99.37,29.29 99.59,29.51 99.59,32.99 99.8,33.2 106.01,33.2 R14.1 110.52,33.61 CN6.2
RF_CS: length 51.1
  Top Layer w0.254: CN6.3 104.28,36.1 103.91,35.72 R15.1 103.91,33.89 103.68,33.66 99.38,33.66 99.13,33.41 99.13,30.03 98.85,29.75 77.85,29.75 77.6,29.5 77.6,27.92 77.34,27.67 U11.33
RF_IRQ: length 77
  Top Layer w0.254: CN6.7 113.51,46.1 113.81,46.4 113.81,50.8 113.51,51.1 R16.1 109.96,52.44 109.8,52.6 103.65,52.6 103.25,52.19 103.25,47.85 102.5,47.1 101.61,47.1 100.75,46.24 100.75,38.18 100.5,37.93 75.88,37.93 75.63,37.67 75.63,30.54 75.26,30.17 U11.38
RF_MISO: length 62.4
  Top Layer w0.254: v1(102.61,37.19) 102.43,37.01 76.87,37.01 76.56,36.71 76.56,29.21 76.02,28.67 U11.35 ; U6.2 104.51,44.47 v1(104.72,44.26) ; CN6.6 110.37,43.44 104.62,43.44 104.35,43.71 104.35,45.67
  Bottom Layer w0.254: v1(102.61,37.19) 102.61,44 102.87,44.26 v1(104.72,44.26)
RF_MOSI: length 54.8
  Top Layer w0.254: U11.36 75.88,29.17 76.11,29.4 76.11,37.22 76.36,37.47 101.55,37.47 101.97,37.89 U6.5 ; CN6.5 102.34,41.1 102.09,40.85 102.09,38.88 101.81,38.61
RF_SCLK: length 54.6
  Top Layer w0.254: 103.28,36.56 107.08,36.56 108.88,38.36 110.29,38.36 CN6.4 ; 103.28,36.56 77.39,36.56 77.14,36.3 77.14,28.38 76.93,28.17 U11.34 ; 103.28,36.56 103.28,38.53 U6.6
S_ADJ: length 83.8
  Top Layer w0.254: v1(61.42,27.02) 61.4,27 U11.25 ; 9.75,58.23 12.23,58.23 R41.2 13.5,58.4 13.69,58.22 13.69,45.67 14,45.36 26.02,45.36 26.27,45.1 26.27,43.39 26.43,43.24 33.55,43.24 33.56,43.23 59.24,43.23 v1(59.25,43.25)
  Bottom Layer w0.254: v1(59.25,43.25) 59.35,43.15 59.35,27.27 59.6,27.02 v1(61.42,27.02)
S_INT: length 19.5
  Top Layer w0.254: v1(61.21,38.8) 60.9,38.49 U11.57 ; v1(61.28,54.55) 63.09,54.55 U5.12
  Bottom Layer w0.254: v1(61.21,38.8) 61.21,54.48 v1(61.28,54.55)
S_SCL: length 19.3
  Top Layer w0.254: R17.1 66.66,46.12 66.38,45.84 60.72,45.84 60.42,45.54 60.42,37.19 U11.58 ; U5.24 65.73,49.5 66.62,48.61 66.62,48.18
S_SDA: length 17.4
  Top Layer w0.254: 64.21,48.19 64.21,48.47 65.23,49.49 U5.23 ; R18.1 64.19,46.63 63.88,46.32 60.2,46.32 59.89,46.01 59.89,38.44 59.9,38.42 U11.59
TIMA_CH1: length 21.9
  Top Layer w0.254: v1(53.89,21.56) 45.21,21.56 44.93,21.28 U2.3 ; v1(53.91,28.81) 54.12,28.81 54.26,28.67 U11.14
  Bottom Layer w0.254: v1(53.89,21.56) 53.91,21.59 v1(53.91,28.81)
TIMA_CH2: length 19.9
  Top Layer w0.254: v1(53.25,20.73) 46.44,20.73 46.2,20.49 U2.2 ; U11.15 53.51,28.17 v1(53.24,27.9)
  Bottom Layer w0.254: v1(53.25,20.73) 53.25,27.89 v1(53.24,27.9)
TIMB_CH1: length 13.8
  Top Layer w0.254: v1(55.56,19.16) 58.4,19.16 58.58,18.99 58.58,16.88 ; U11.16 55.48,27.59 v1(55.48,27.14)
  Bottom Layer w0.254: v1(55.48,27.14) 55.56,27.05 v1(55.56,19.16)
TIMB_CH2: length 11
  Top Layer w0.254: U11.17 57.42,25.65 57.42,19.92 57.66,19.67 59.63,19.67 59.85,19.45 59.85,16.88
TIMC_CH1: length 22.7
  Top Layer w0.254: U11.20 58.9,20.38 59.15,20.13 72.65,20.13 72.91,19.87 U3.3
TIMC_CH2: length 23.5
  Top Layer w0.254: U11.21 59.4,24.42 59.41,24.41 59.41,20.84 59.66,20.59 73.94,20.59 74.18,20.35 U3.2
TIMD_CH1: length 35.6
  Top Layer w0.254: U11.22 59.9,21.3 60.16,21.04 86.82,21.04 87.1,20.77 U1.3
TIMD_CH2: length 36.3
  Top Layer w0.254: U11.23 60.42,25.65 60.42,21.79 60.71,21.5 88.04,21.5 88.37,21.17 U1.2
USB_DN: length 76
  Top Layer w0.254: USB1.5 6.06,21.59 5.92,21.44 5.92,20.74 v1(6.07,20.59) 7.21,20.59 USB1.7 ; U11.44 66.88,33.15 66.51,33.15 66.49,33.16 65.04,33.16 64.86,32.98 64.86,28.38 64.6,28.12 58.03,28.12 56.92,27.01 56.92,23.77 56.47,23.32 31.75,23.32 31.54,23.11 31.54,20.62 31.29,20.36 21.79,20.36 21.61,20.19 v1(20.71,20.19)
  Bottom Layer w0.254: v1(20.71,20.19) 20.54,20.36 6.14,20.36 5.99,20.51 5.99,20.55
USB_DP: length 76.2
  Top Layer w0.254: USB1.8 8.02,20.09 8.28,20.35 v1(8.28,21.07) 7.23,21.07 USB1.6 ; U11.45 65.65,33.67 65.62,33.65 64.66,33.65 64.4,33.39 64.4,28.82 64.17,28.58 57.84,28.58 56.46,27.2 56.46,24.12 56.12,23.77 31.16,23.77 30.91,23.52 30.91,21.07 30.66,20.82 20.92,20.82 v1(20.74,21)
  Bottom Layer w0.254: v1(20.74,21) 20.57,20.82 12.34,20.82 12.17,21 12.17,21.62 11.99,21.8 11.84,21.8 11.66,21.62 11.66,21 11.48,20.82 11.33,20.82 11.15,21 11.15,21.62 10.97,21.8 10.82,21.8 10.64,21.62 10.64,21 10.46,20.82 8.53,20.82 v1(8.28,21.07)
USR_LED1: length 76
  Top Layer w0.254: LED2.1 12.97,55.88 13.23,55.62 13.23,45.09 13.42,44.9 25.61,44.9 25.82,44.69 25.82,43.03 26.08,42.78 54.08,42.78 54.34,42.52 54.34,36.05 54.62,35.77 62.65,35.77 62.9,36.02 U11.53
USR_LED2: length 65.3
  Top Layer w0.254: LED3.1 12.52,52.89 12.77,52.64 12.77,44.67 13,44.44 25.17,44.44 25.36,44.25 25.36,42.46 25.5,42.32 53.66,42.32 53.88,42.1 53.88,35 54.21,34.67 U11.2
USR_LED3: length 62.3
  Top Layer w0.254: LED4.1 12.09,49.65 12.31,49.42 12.31,44.24 12.57,43.98 24.73,43.98 24.9,43.81 24.9,42.05 25.09,41.86 53.09,41.86 53.37,41.58 53.37,34.81 54.01,34.17 U11.3
USR_LED4: length 59.6
  Top Layer w0.254: 7.54,46.58 11.63,46.58 11.86,46.35 11.86,43.75 12.08,43.53 24.25,43.53 24.44,43.33 24.44,41.62 24.67,41.4 27.47,41.4 27.47,41.4 52.66,41.4 52.91,41.16 52.91,34.62 53.86,33.67 U11.4
$1N2668: length 15.1
  Top Layer w0.254: RT1.2 50.64,62.98 U12.3 ; C8.2 46.13,63.35 R2.2 50.9,63.45
$1N3435: length 12.8
  Top Layer w0.254: RT2.2 46.33,50.9 46.61,50.62 R4.2 46.69,47.78 48.91,47.78 49.35,48.22 49.35,50.67
$1N4661: length 14.1
  Top Layer w0.254: C6.2 28.65,63.55 R1.2 29.08,63.81 RT4.2 ; 33.23,63.18 U13.3
$1N4689: length 13.1
  Top Layer w0.254: 28.77,47.7 28.91,47.56 31.35,47.56 31.96,48.16 U13.5 ; 28.77,47.7 R3.2 ; 28.77,47.7 28.77,50.54 28.51,50.79 RT3.2
$1N12389: length 3.2
  Top Layer w0.254: U2.7 46.2,10.94 46.95,10.19 R6.1
$1N12395: length 10.7
  Top Layer w0.254: U2.8 47.88,11.67 48.16,11.39 48.16,5.14 47.81,4.79 45.81,4.79 45.81,4.78 CN1.1
$1N12398: length 11.7
  Top Layer w0.254: CN1.3 39.96,5.09 39.96,9.81 40.21,10.07 44.68,10.07 44.93,10.31 U2.6
$1N13149: length 3.2
  Top Layer w0.254: R8.1 60.52,8.6 60.52,9.8 59.85,10.47 U4.7
$1N13151: length 11.2
  Top Layer w0.254: U4.8 61.28,11.51 61.91,11.51 62.19,11.23 62.19,4.88 61.94,4.62 CN2.1
$1N13153: length 11.1
  Top Layer w0.254: CN2.3 53.98,4.92 53.98,9.65 54.24,9.91 58.32,9.91 58.58,10.17 U4.6
$1N13495: length 3.3
  Top Layer w0.254: U1.7 88.37,10.4 89.29,9.48 89.29,8.68 R5.1
$1N13497: length 10.5
  Top Layer w0.254: CN4.1 90.37,4.66 90.75,5.04 90.75,11.19 90.52,11.41 U1.8
$1N13499: length 10.8
  Top Layer w0.254: CN4.3 82.7,9.54 82.97,9.82 86.7,9.82 87.1,10.22 U1.6
$1N13841: length 3.1
  Top Layer w0.254: 74.92,8.38 74.92,9.34 74.18,10.08 U3.7
$1N13843: length 9.8
  Top Layer w0.254: U3.8 76.05,11.13 76.35,10.83 76.35,5.09 75.88,4.62 CN3.1
$1N13845: length 10.5
  Top Layer w0.254: CN3.3 68.5,4.64 68.5,9.15 68.92,9.58 72.58,9.58 72.91,9.92 U3.6
$2N966: length 21.5
  Top Layer w0.254: U7.11 113.73,6.83 113.42,7.15 113.42,17.67 113.08,18.02 108.66,18.02 108.38,18.3 U8.4
$2N1017: length 2.5
  Top Layer w0.254: 110.1,21.79 110.23,21.66 ; L1.1 110.24,21.75 U8.1
$2N1310: length 2.5
  Top Layer w0.254: C37.2 108.18,24.13 L1.2
$2N1635: length 9.4
  Top Layer w0.254: C37.1 110.47,26.69 115.1,26.69 115.56,26.24 115.56,22.57 RF1.5
$2N1762: length 10
  Top Layer w0.254: C35.2 115.06,17.06 115.06,10.45 115.38,10.13 U7.14
$2N1963: length 33.7
  Top Layer w0.254: BT1.1 97.3,27 97.3,24.76 97.56,24.51 102.09,24.51 102.57,24.03 102.57,16.04 102.82,15.78 110.81,15.78 111.42,15.18 111.42,9.38 111.08,9.03 U7.6
$2N2085: length 2.6
  Top Layer w0.254: U7.2 106.86,13.43 R21.2
$2N2141: length 2.7
  Top Layer w0.254: U7.3 106.89,12.33 R22.2
$2N2347: length 4.2
  Top Layer w0.254: U7.4 107.62,11.23 107.36,10.97 107.36,9.41 107.12,9.17 R23.2
$2N2350: length 2.7
  Top Layer w0.254: LED1.1 104.28,6.6 R23.1
$2N3257: length 6.1
  Top Layer w0.254: U5.9 64.73,58.57 64.51,58.79 R19.2
$2N3275: length 3.2
  Top Layer w0.254: U5.10 64.25,54.43 64.25,56.12 64.03,56.35 C32.1
$2N3619: length 4.8
  Top Layer w0.254: C31.2 60.35,49.89 60.67,49.57 63.53,49.57 63.73,49.77 U5.20
$2N3742: length 13.1
  Top Layer w0.254: H1.3 70.59,53.94 70.31,53.66 U5.6
$2N3752: length 10.5
  Top Layer w0.254: H1.2 68.05,54.74 67.72,54.41 U5.7
$2N4604: length 10.2
  Top Layer w0.254: R11.2 102.1,57.83 102.55,57.38 CN5.4
$2N4608: length 5.6
  Top Layer w0.254: R10.2 94.46,55.51 CN5.5
$2N4932: length 16
  Top Layer w0.254: CN5.3 CN5.2 107.55,60.16 108.21,60.82 Q1.3
$2N5169: length 4.8
  Top Layer w0.254: 89.15,50.5 89.3,50.64 R13.2 93.52,50.64 Q2.1
$2N5247: length 25.9
  Top Layer w0.254: Q1.1 115.34,58.4 R9.1 115.34,54.16 C27.1 114.45,53.26 95.05,53.26 94.71,52.92 Q2.3
$3N4980: length 2.6
  Top Layer w0.254: R29.1 9.45,19.09 USB1.10
$3N4986: length 2.7
  Top Layer w0.254: R30.1 9.27,22.09 USB1.4
$3N6297: length 11.2
  Top Layer w0.254: R32.2 R31.2 28.08,4.5 C48.1 30.44,4.33 D8.1 30.95,6.49 U14.5
$3N44657: length 21.5
  Top Layer w0.254: U9.3 U9.2 20.33,34.95 C43.1
  Top Layer w0.508: C43.1 21.34,35.96 21.34,38.13 20.98,38.49 14.56,38.49 14.16,38.89 14.16,41.73 C42.1 13.29,42.6 D5.1
$3N44801: length 2
  Top Layer w0.254: U9.4 18.73,33.88 R27.1
$3N44806: length 2.4
  Top Layer w0.508: C40.1 26.17,28.01 R28.2
$3N44813: length 4.9
  Top Layer w0.254: C41.2 19.51,28.4 U9.6
  Top Layer w0.508: R28.1 21.76,27.95 C41.2
$3N44886: length 23
  Top Layer w0.254: U9.8 22.36,29.86 C44.1
  Top Layer w0.508: C44.1 26.94,31.13 D6.1 29.59,31.11 29.91,30.79 29.91,23.36 29.58,23.03 L2.1
$3N44904: length 2.8
  Top Layer w0.254: C44.2 22.97,33.85 U9.1
$3N44930: length 5.4
  Top Layer w0.254: U9.5 17.22,29.86 R26.1 16.37,31.14
  Top Layer w0.508: R25.2 16.37,33.31 16.37,31.14
$3N44946: length 3.2
  Top Layer w0.508: R24.2 14.31,36.38 R25.1
$3N45005: length 15.8
  Top Layer w0.254: U14.3 26.7,8.47 26.89,8.28 26.89,6.19 26.67,5.97 22.47,5.97 22.46,5.96 20.12,5.96 19.87,5.71 R34.1 R33.1
$3N45031: length 18.9
  Top Layer w0.254: PR1.2 15,7.87 15.22,7.66 15.22,6.79 15.43,6.58 22.95,6.58 23.28,6.9 23.28,9.46 23.55,9.74 U14.2
$4N1687: length 20
  Top Layer w0.254: R42.1 58.55,44.6 v1(58.52,44.58) ; U11.13 56.68,29.17 v1(56.89,28.96)
  Bottom Layer w0.254: v1(58.52,44.58) 58.58,44.52 58.58,29.44 58.1,28.96 v1(56.89,28.96)
$4N1976: length 24.9
  Top Layer w0.254: U11.7 53.99,32.17 53.04,31.22 ; 53.04,31.22 53.04,28.6 52.44,28 52.44,24.52 52.15,24.23 41.63,24.23 41.22,24.65 C55.1 38.99,26.02 R40.1
$4N3396: length 30.8
  Top Layer w0.254: U11.49 64.9,40.33 65.27,40.7 77.06,40.7 77.39,41.03 77.39,52.13 77.38,52.15 R43.2
$4N3397: length 4.9
  Top Layer w0.254: H2.1 77.47,58 R43.1
$4N3426: length 39.4
  Top Layer w0.254: R45.2 85.15,40.54 84.86,40.24 73.57,40.24 73.3,39.97 73.3,34.41 73.06,34.17 U11.46
$4N3427: length 5
  Top Layer w0.254: H2.4 85.09,57.86 R45.1
$4N3881: length 9.8
  Top Layer w0.254: R41.1 18.08,60.4 18.42,60.06 PR2.2
$4N4060: length 3.4
  Top Layer w0.254: 58.48,40.22 58.48,39.93 58.52,39.9 ; R39.2 59.4,38.95 U11.60
$4N4288: length 2.3
  Top Layer w0.254: R35.1 5.83,55.87 5.83,55.88
$4N4290: length 2.3
  Top Layer w0.254: LED3.2 5.85,52.93 R36.1
$4N4292: length 2.4
  Top Layer w0.254: LED4.2 5.95,49.64 R37.1
$4N4294: length 2.4
  Top Layer w0.254: R38.1 5.91,46.6 LED5.2

## Copper pours and planes (outline as drawn; the poured copper is in the pictures)
+5V0 on Top Layer: 7.84,31.75 19.32,31.75 19.32,14.54 7.84,14.54
GND on Top Layer: -2.53,66.65 125.42,66.65 126.98,65.09 126.98,-3.82 125.6,-5.2 -4.08,-5.2 -4.43,-5.55 -4.43,64.74
GND on Bottom Layer: -3.91,67.34 123.69,67.34 125.94,65.09 125.94,-6.93 125.42,-7.46 -2.53,-7.46 -3.91,-6.07
VBAT on Top Layer: 77.52,12.35 86.18,12.35 86.18,6.38 77.52,6.38
VBAT on Top Layer: 63.11,12.2 71.99,12.2 71.99,6.53 63.11,6.53
VBAT on Top Layer: 48.82,12.31 57.63,12.31 57.63,6.4 48.82,6.4
VBAT on Top Layer: 34.5,12.73 43.99,12.73 43.99,6.12 34.5,6.12

Small or netless copper shapes (teardrops, artwork), in the pictures only: 515 on Top Layer, 82 on Bottom Layer

## Text on the board
Top Silkscreen Layer: VDD | GND | A14 | A13
